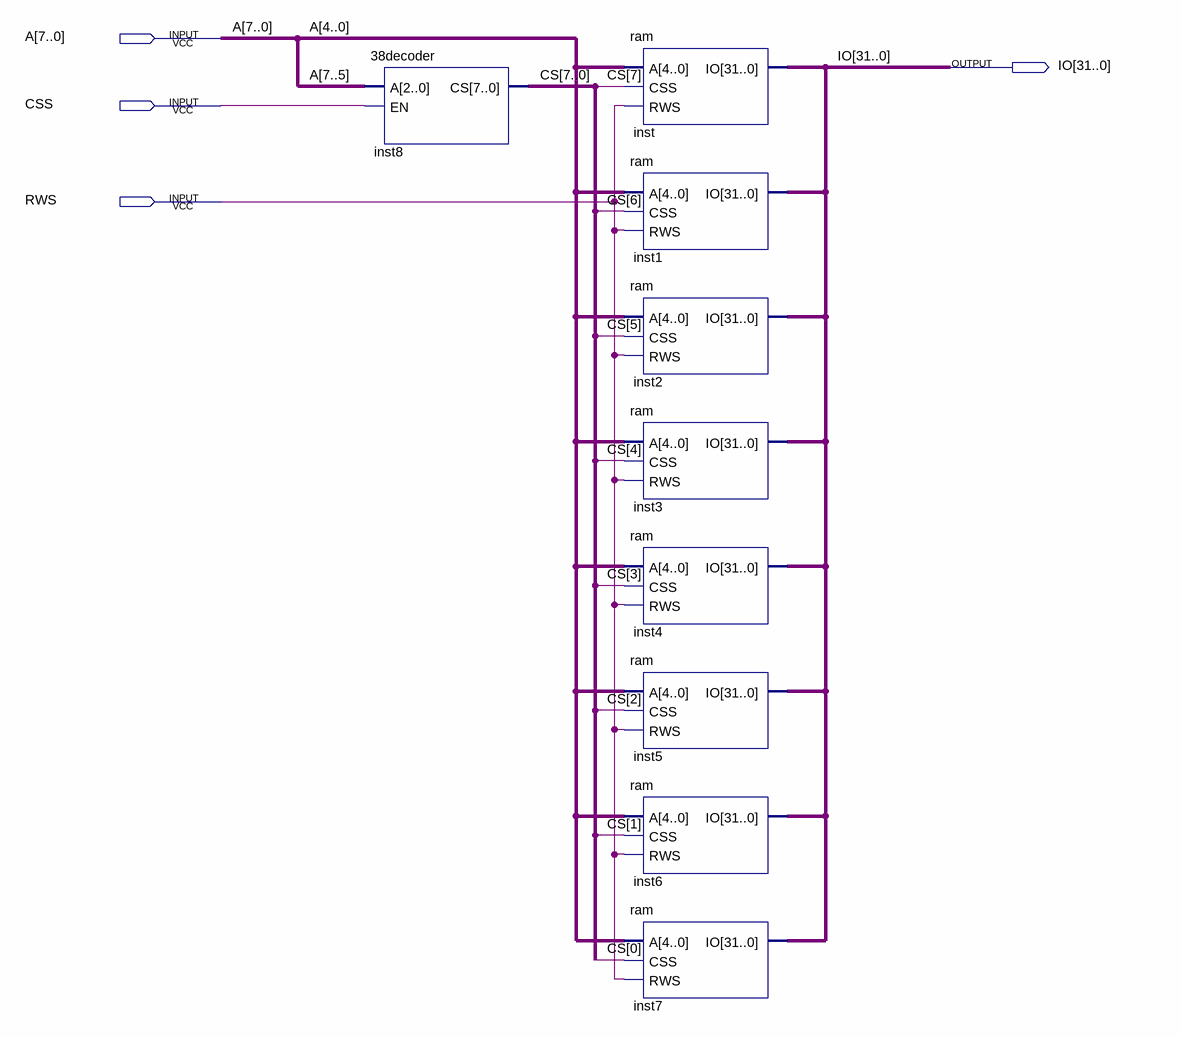
[diagram p0: schematic sheet]
// Quartus schematic 1KRAM.bdf as structural Verilog: 9 symbols, 4 pins
module \1KRAM  (
  input  [7:0] A,
  input  CSS,
  input  RWS,
  output [31:0] IO
);

  wire [7:0] CS;

  \38decoder  inst8 (.A(A[7:5]), .EN(CSS), .CS(CS));
  ram inst (.A(A[4:0]), .CSS(CS[7]), .RWS(RWS), .IO(IO));
  ram inst1 (.A(A[4:0]), .CSS(CS[6]), .RWS(RWS), .IO(IO));
  ram inst2 (.A(A[4:0]), .CSS(CS[5]), .RWS(RWS), .IO(IO));
  ram inst3 (.A(A[4:0]), .CSS(CS[4]), .RWS(RWS), .IO(IO));
  ram inst4 (.A(A[4:0]), .CSS(CS[3]), .RWS(RWS), .IO(IO));
  ram inst5 (.A(A[4:0]), .CSS(CS[2]), .RWS(RWS), .IO(IO));
  ram inst6 (.A(A[4:0]), .CSS(CS[1]), .RWS(RWS), .IO(IO));
  ram inst7 (.A(A[4:0]), .CSS(CS[0]), .RWS(RWS), .IO(IO));
endmodule
